# Altium schematic sheet ZYNQ_US_SOC_PL.SchDoc
size A3; DocumentNumber: 53; SheetNumber: 53; SheetTotal: 54
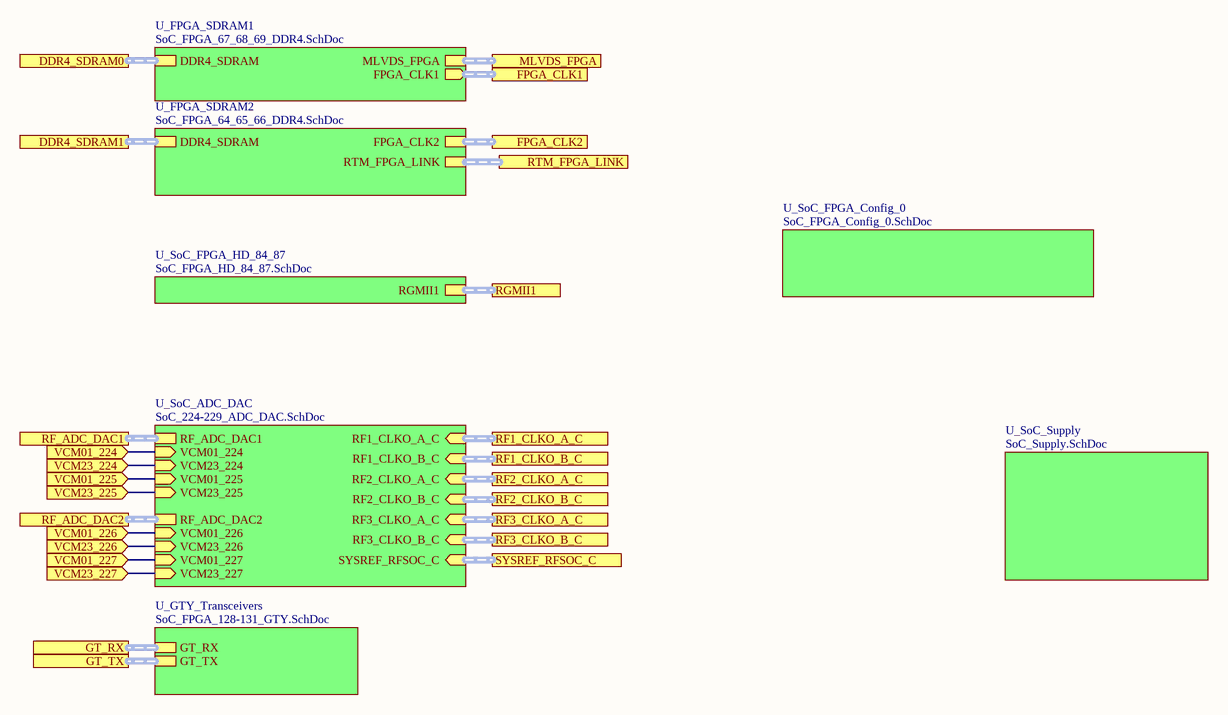
[diagram p0: ZYNQ_US_SOC_PL.SchDoc]

## Sub-sheets
U_FPGA_SDRAM1 = SoC_FPGA_67_68_69_DDR4.SchDoc: DDR4_SDRAM (harness DDR4), FPGA_CLK1 (out, harness CLK), MLVDS_FPGA (harness MLVDS)
U_FPGA_SDRAM2 = SoC_FPGA_64_65_66_DDR4.SchDoc: DDR4_SDRAM (harness DDR4), FPGA_CLK2 (harness CLK), RTM_FPGA_LINK (harness RTM_FPGA_LINK)
U_GTY_Transceivers = SoC_FPGA_128-131_GTY.SchDoc: GT_RX (harness GT_RX), GT_TX (harness GT_TX)
U_SoC_ADC_DAC = SoC_224-229_ADC_DAC.SchDoc: RF_ADC_DAC1 (harness RF_ADC_DAC), RF_ADC_DAC2 (harness RF_ADC_DAC), VCM01_227 (in), VCM01_225 (in), VCM23_227 (in), VCM01_224 (in), VCM23_225 (in), VCM23_224 (in), VCM23_226 (in), VCM01_226 (in), RF1_CLKO_A_C (in, harness CLK), RF1_CLKO_B_C (in, harness CLK), RF2_CLKO_A_C (in, harness CLK), RF2_CLKO_B_C (in, harness CLK), RF3_CLKO_A_C (in, harness CLK), RF3_CLKO_B_C (in, harness CLK), SYSREF_RFSOC_C (in, harness SYSREF)
U_SoC_FPGA_Config_0 = SoC_FPGA_Config_0.SchDoc: no entries
U_SoC_FPGA_HD_84_87 = SoC_FPGA_HD_84_87.SchDoc: RGMII1 (harness RGMII)
U_SoC_Supply = SoC_Supply.SchDoc: no entries

## Ports
DDR4_SDRAM0, DDR4_SDRAM1, FPGA_CLK1 (harness DIFF_CLK), FPGA_CLK2 (harness DIFF_CLK), GT_RX (harness GT_RX), GT_TX (harness GT_TX), MLVDS_FPGA (harness MLVDS), RF1_CLKO_A_C (harness CLK), RF1_CLKO_B_C (harness CLK), RF2_CLKO_A_C (harness CLK), RF2_CLKO_B_C (harness CLK), RF3_CLKO_A_C (harness CLK), RF3_CLKO_B_C (harness CLK), RF_ADC_DAC1 (harness RF_ADC_DAC), RF_ADC_DAC2 (harness RF_ADC_DAC), RGMII1 (harness RGMII), RTM_FPGA_LINK (harness RTM_FPGA_LINK), SYSREF_RFSOC_C (harness SYSREF), VCM01_224 (in), VCM01_225 (in), VCM01_226 (in), VCM01_227 (in), VCM23_224 (in), VCM23_225 (in), VCM23_226 (in), VCM23_227 (in)

## Nets
VCM01_224: port VCM01_224, sheet U_SoC_ADC_DAC/VCM01_224
VCM01_225: port VCM01_225, sheet U_SoC_ADC_DAC/VCM01_225
VCM01_226: port VCM01_226, sheet U_SoC_ADC_DAC/VCM01_226
VCM01_227: port VCM01_227, sheet U_SoC_ADC_DAC/VCM01_227
VCM23_224: port VCM23_224, sheet U_SoC_ADC_DAC/VCM23_224
VCM23_225: port VCM23_225, sheet U_SoC_ADC_DAC/VCM23_225
VCM23_226: port VCM23_226, sheet U_SoC_ADC_DAC/VCM23_226
VCM23_227: port VCM23_227, sheet U_SoC_ADC_DAC/VCM23_227

## Buses and harness runs
harness port DDR4_SDRAM0 = sheet U_FPGA_SDRAM1/DDR4_SDRAM
harness port DDR4_SDRAM1 = sheet U_FPGA_SDRAM2/DDR4_SDRAM
harness port FPGA_CLK1 = sheet U_FPGA_SDRAM1/FPGA_CLK1
harness port FPGA_CLK2 = sheet U_FPGA_SDRAM2/FPGA_CLK2
harness port GT_RX = sheet U_GTY_Transceivers/GT_RX
harness port GT_TX = sheet U_GTY_Transceivers/GT_TX
harness port MLVDS_FPGA = sheet U_FPGA_SDRAM1/MLVDS_FPGA
harness port RF1_CLKO_A_C = sheet U_SoC_ADC_DAC/RF1_CLKO_A_C
harness port RF1_CLKO_B_C = sheet U_SoC_ADC_DAC/RF1_CLKO_B_C
harness port RF2_CLKO_A_C = sheet U_SoC_ADC_DAC/RF2_CLKO_A_C
harness port RF2_CLKO_B_C = sheet U_SoC_ADC_DAC/RF2_CLKO_B_C
harness port RF3_CLKO_A_C = sheet U_SoC_ADC_DAC/RF3_CLKO_A_C
harness port RF3_CLKO_B_C = sheet U_SoC_ADC_DAC/RF3_CLKO_B_C
harness port RF_ADC_DAC1 = sheet U_SoC_ADC_DAC/RF_ADC_DAC1
harness port RF_ADC_DAC2 = sheet U_SoC_ADC_DAC/RF_ADC_DAC2
harness port RGMII1 = sheet U_SoC_FPGA_HD_84_87/RGMII1
harness port RTM_FPGA_LINK = sheet U_FPGA_SDRAM2/RTM_FPGA_LINK
harness port SYSREF_RFSOC_C = sheet U_SoC_ADC_DAC/SYSREF_RFSOC_C